# EAGLE design 8bit_probe (EAGLE 5.06)
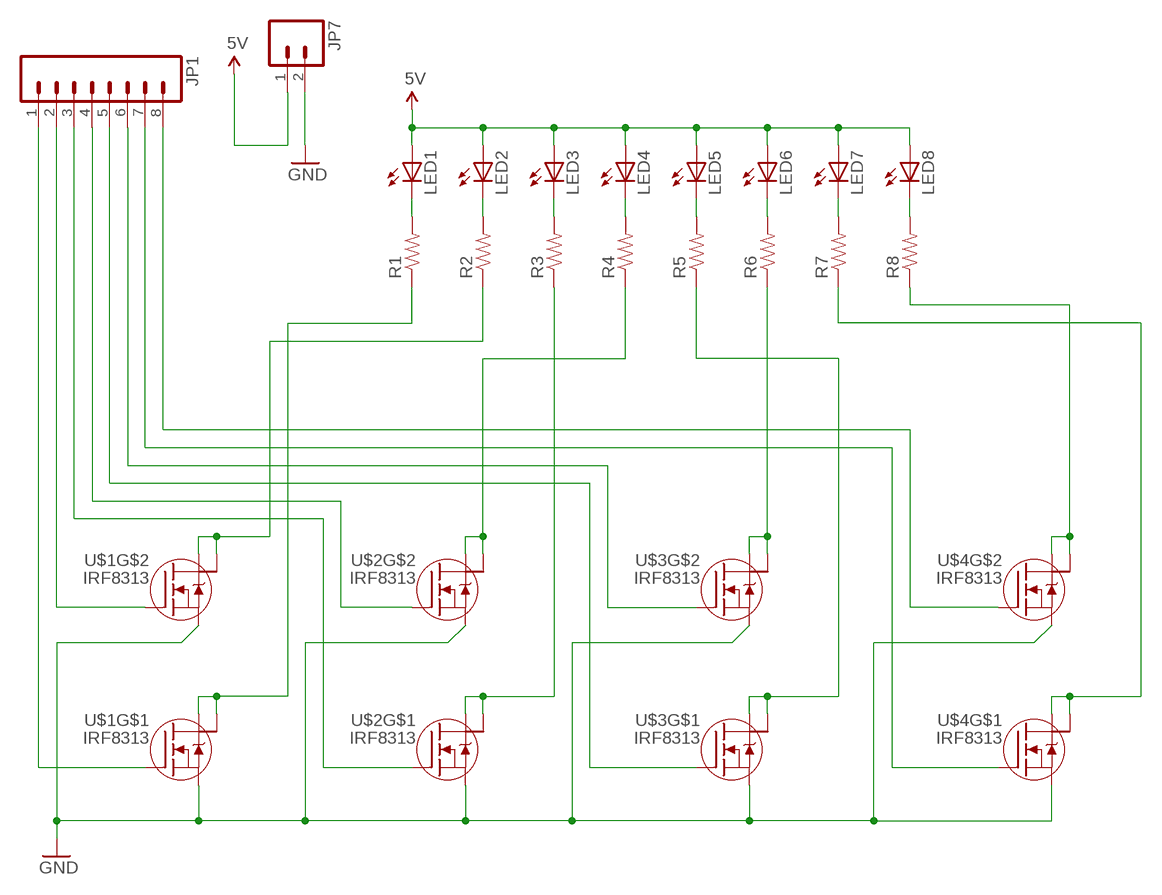
[diagram p0: schematic, sheet 1]

## Parts
JP1  M08  [1X08]
JP7  M02-JST-2MM-SMT  [S2B-PH]
LED1  LED1206  [LED-1206]
LED2  LED1206  [LED-1206]
LED3  LED1206  [LED-1206]
LED4  LED1206  [LED-1206]
LED5  LED1206  [LED-1206]
LED6  LED1206  [LED-1206]
LED7  LED1206  [LED-1206]
LED8  LED1206  [LED-1206]
R1  RESISTOR  [0805]
R2  RESISTOR  [0805]
R3  RESISTOR  [0805]
R4  RESISTOR  [0805]
R5  RESISTOR  [0805]
R6  RESISTOR  [0805]
R7  RESISTOR  [0805]
R8  RESISTOR  [0805]
U$1  IRF8313  [SO08]
U$2  IRF8313  [SO08]
U$3  IRF8313  [SO08]
U$4  IRF8313  [SO08]

## Nets
5V: JP7.1 LED1.A LED2.A LED3.A LED4.A LED5.A LED6.A LED7.A LED8.A
GATE1: JP1.1 U$1.4(G)
GATE2: JP1.2 U$1.2(G)
GATE3: JP1.3 U$2.4(G)
GATE4: JP1.4 U$2.2(G)
GATE5: JP1.5 U$3.4(G)
GATE6: JP1.6 U$3.2(G)
GATE7: JP1.7 U$4.4(G)
GATE8: JP1.8 U$4.2(G)
GND: JP7.2 U$1.1(S) U$1.3(S) U$2.1(S) U$2.3(S) U$3.1(S) U$3.3(S) U$4.1(S) U$4.3(S)
N$1: LED1.C R1.2
N$2: LED2.C R2.2
N$3: LED3.C R3.2
N$4: LED4.C R4.2
N$5: LED5.C R5.2
N$6: LED6.C R6.2
N$7: LED7.C R7.2
N$8: LED8.C R8.2
N$9: R6.1 U$3.7(D) U$3.8(D)
N$10: R8.1 U$4.7(D) U$4.8(D)
N$12: R3.1 U$2.5(D) U$2.6(D)
N$13: R4.1 U$2.7(D) U$2.8(D)
N$14: R5.1 U$3.5(D) U$3.6(D)
N$15: R2.1 U$1.7(D) U$1.8(D)
N$16: R7.1 U$4.5(D) U$4.6(D)
N$19: R1.1 U$1.5(D) U$1.6(D)

## Library data of the parts
JP1 = SparkFun:M08: Header 8 Standard 8-pin 0.1" header. Use with straight break away headers (SKU : PRT-00116), right angle break away headers (PRT-00553), swiss pins (PRT-00743), machine pins (PRT-00117), and female headers (PRT-00115).
JP7 = SparkFun:M02: Header 2 Standard 2-pin 0.1" header. Use with straight break away headers (SKU : PRT-00116), right angle break away headers (PRT-00553), swiss pins (PRT-00743), machine pins (PRT-00117), and female headers (PRT-00115). Molex polarized connector foot print use with SKU : PRT-08233 with associated crimp pins and housings.
LED1-LED8 = SparkFun:LED: LEDs Standard schematic elements and footprints for 5mm, 3mm, 1206, and 0603 sized LEDs. 5mm - Spark Fun Electronics SKU : COM-00529 (and others)
R1-R8 = SparkFun:RESISTOR: Resistor Basic schematic elements and footprints for 0603, 1206, and PTH 1/10th watt (small) resistors.
U$1-U$4 = led-stuff:IRF8313: Dual N-Channel HEXFET® Power MOSFET Applications Load Switch DC/DC Converters Benefits Low Gate Charge and Low RDS(on) Fully Characterized Avalanche Voltage and Current 20V VGS Max. Gate Rating 100% Tested for RG Lead-Free (Qualified to 260°C Reflow) RoHS Compliant (Halogen Free) RDS(ON) 12.5mΩ @VGS = 10V 18.6mΩ @VGS = 4.5V Maximum Ratings VGS = 20V VDS = 30V IDS = 9.7A

## Board
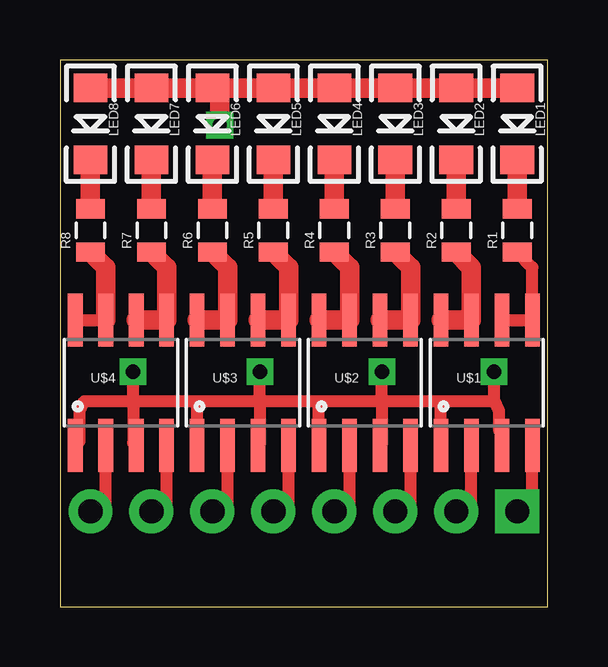
[diagram p1: board, top side]
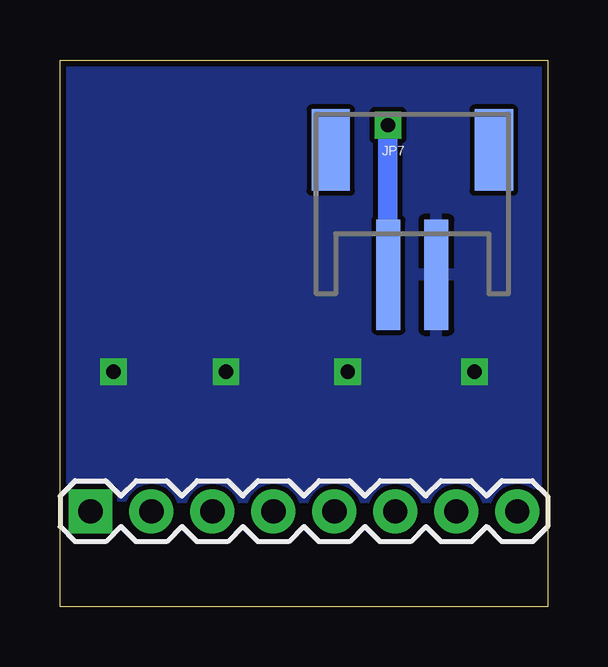
[diagram p2: board, bottom side, seen from below]

Size 20.32 x 22.81 mm. Coordinates in mm from the lower left corner, seen from the top.
Outline: 0,0 20.32,0 20.32,22.81 0,22.81 0,0
Copper layers (1*16): Top 0.035mm / dielectric 1.5mm / Bottom 0.035mm
Design rules "SparkFun": minimum track width 8mil, minimum drill 20mil, track to track 8mil, track to pad 8mil, pad to pad 8mil, via to via 8mil, smd to smd 8mil, copper to edge 10mil, drill to drill 8mil, minimum pad ring 12mil, minimum via ring 10mil, stop-mask expansion 4mil, vias tented up to drill 25mil, thermal gap 10mil

### Footprints (pad centres in the part's own frame; a part is rotated, then mirrored left to right if it is on the bottom)
1X08 = drill 1.016 pad 1.829 square: 1 0,0 | drill 1.016 pad 1.829 round: 2 2.54,0; 3 5.08,0; 4 7.62,0; 5 10.16,0; 6 12.7,0; 7 15.24,0; 8 17.78,0
S2B-PH = smd 1 x 4.6: 1 -1,-3.7; 2 1,-3.7 | smd 1.6 x 3.4: NC1 -3.4,1.5; NC2 3.4,1.5
LED-1206 = smd 1.2 x 1.4: A -1.5,0; C 1.5,0
0805 = smd 0.8 x 1.2: 1 -0.9,0; 2 0.9,0
SO08 = smd 0.61 x 2.21: 1 -1.905,-2.616; 2 -0.635,-2.616; 3 0.635,-2.616; 4 1.905,-2.616; 5 1.905,2.616; 6 0.635,2.616; 7 -0.635,2.616; 8 -1.905,2.616

### Placement (x,y rotation side)
JP1  19.05,3.99 0 bottom
JP7  5.64,17.55 0 bottom
LED1  19.05,20.14 270 top
LED2  16.51,20.14 270 top
LED3  13.97,20.14 270 top
LED4  11.43,20.14 270 top
LED5  8.89,20.14 270 top
LED6  6.35,20.14 270 top
LED7  3.81,20.14 270 top
LED8  1.27,20.14 270 top
R1  19.05,15.7 90 top
R2  16.51,15.7 90 top
R3  13.97,15.7 90 top
R4  11.43,15.7 90 top
R5  8.89,15.7 90 top
R6  6.35,15.7 90 top
R7  3.81,15.7 90 top
R8  1.27,15.7 90 top
U$1  17.78,9.35 0 top
U$2  12.7,9.35 0 top
U$3  7.62,9.35 0 top
U$4  2.54,9.35 0 top

### Tracks (layer width: path | path; a pad name or v marks a point on that pad's centre or on a via)
5V  (via drill 0.6)
  Top 0.203: LED8.A 1.22,21.64
  Top 0.406: 6.66,21.64 6.78,21.64
  Top 0.508: 6.78,21.64 5.49,21.71
  Top 0.813: LED8.A LED7.A LED6.A 6.78,21.64 LED5.A LED4.A LED3.A LED2.A LED1.A | v6.66,20.09 6.66,21.64
  Bottom 0.813: JP7.1 6.66,15.8 v6.66,20.09
GATE1
  Top 0.508: JP1.1 19.68,3.99 U$1.4
GATE2
  Top 0.508: JP1.2 17.14,3.99 U$1.2
GATE3
  Top 0.508: JP1.3 14.61,3.99 U$2.4
GATE4
  Top 0.508: JP1.4 12.06,3.99 U$2.2
GATE5
  Top 0.508: JP1.5 9.53,3.99 U$3.4
GATE6
  Top 0.508: JP1.6 6.99,3.99 U$3.2
GATE7
  Top 0.508: JP1.7 4.45,3.99 U$4.4
GATE8
  Top 0.508: JP1.8 1.91,3.99 U$4.2
GND  (via drill 0.6)
  Top 0.508: U$4.1 0.81,6.91 0.81,8.18 1.02,8.59 3.05,8.59 | 3.05,8.59 5.69,8.59 | 5.69,8.59 8.33,8.59 | 8.33,8.59 10.77,8.59 | 10.77,8.59 13.41,8.59 | 13.41,8.59 15.85,8.59 | 15.85,8.59 18.09,8.59 | 18.09,8.59 18.29,8.18 18.29,7.37 18.41,7.24 U$1.3 | U$4.3 3.05,6.86 3.05,8.59 | U$3.1 5.69,6.76 5.69,8.59 | U$3.3 8.33,6.81 8.33,8.59 | U$2.1 10.77,6.76 10.77,8.59 | U$2.3 13.41,6.81 13.41,8.59 | U$1.1 15.85,6.76 15.85,8.59 | 3.05,8.59 v3.05,9.8 | 8.33,8.59 v8.33,9.8 | 13.41,8.59 v13.41,9.8 | 18.09,8.59 v18.09,9.8
  pour Bottom: 0,22.81 20.32,22.81 20.32,0 0,0
N$1
  Top 0.813: R1.2 LED1.C
N$2
  Top 0.813: R2.2 LED2.C
N$3
  Top 0.813: R3.2 LED3.C
N$4
  Top 0.813: R4.2 LED4.C
N$5
  Top 0.813: R5.2 LED5.C
N$6
  Top 0.813: R6.2 LED6.C
N$7
  Top 0.813: R7.2 LED7.C
N$8
  Top 0.813: R8.2 LED8.C
N$9
  Top 0.813: U$3.8 U$3.7 6.99,14.16 R6.1
N$10
  Top 0.508: U$4.8 U$4.7
  Top 0.813: R8.1 1.91,14.16 U$4.7
N$12
  Top 0.813: U$2.6 U$2.5 14.61,14.16 R3.1
N$13
  Top 0.813: U$2.8 U$2.7 12.06,14.16 R4.1
N$14
  Top 0.813: U$3.6 U$3.5 9.53,14.16 R5.1
N$15
  Top 0.813: U$1.8 U$1.7 17.14,14.16 R2.1
N$16
  Top 0.813: U$4.6 U$4.5 4.45,14.16 R7.1
N$19
  Top 0.508: U$1.6 U$1.5 19.68,14.16 R1.1